# Altium schematic sheet 03_ZYNQ_JTAG_BOOT.SchDoc
size 297 x 209 mm; SheetNumber: 3; SheetTotal: 7
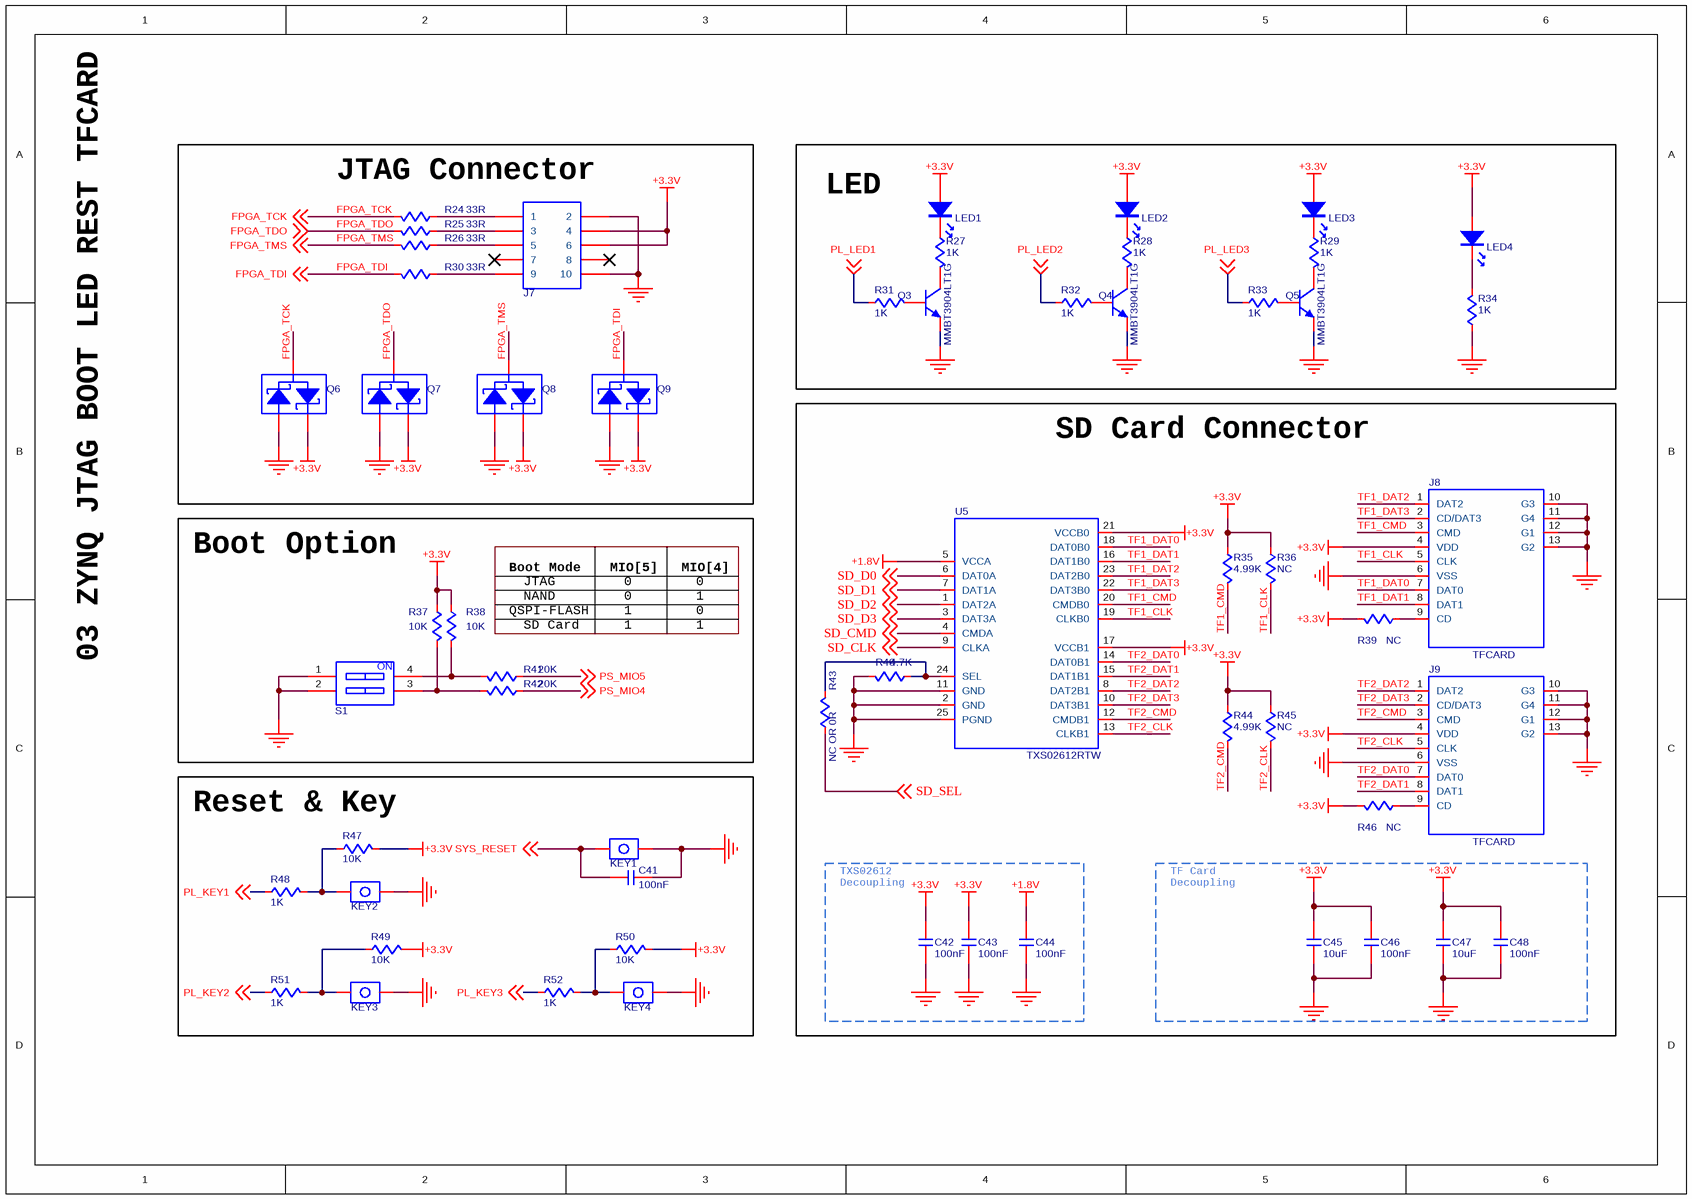
[diagram p0: 03_ZYNQ_JTAG_BOOT.SchDoc]

## Parts
C41  value 100nF  [C0402]  (hidden comment: C-NOMO)
C42  value 100nF  [C0402]  (hidden comment: C-NOMO)
C43  value 100nF  [C0402]  (hidden comment: C-NOMO)
C44  value 100nF  [C0402]  (hidden comment: C-NOMO)
C45  value 10uF  [C0805]  (hidden comment: C-NOMO)
C46  value 100nF  [C0402]  (hidden comment: C-NOMO)
C47  value 10uF  [C0805]  (hidden comment: C-NOMO)
C48  value 100nF  [C0402]  (hidden comment: C-NOMO)
J7  HDR2X5  [HDR2X5-NJ]  (value not drawn)
J8  TFCARD  [TFCARD]
J9  TFCARD  [TFCARD]
KEY1  KEY  [KEY735SO]  (value not drawn)
KEY2  KEY  [KEY735SO]  (value not drawn)
KEY3  KEY  [KEY735SO]  (value not drawn)
KEY4  KEY  [KEY735SO]  (value not drawn)
LED1  LED  [LED0603]  (value not drawn)
LED2  LED  [LED0603]  (value not drawn)
LED3  LED  [LED0603]  (value not drawn)
LED4  LED  [LED0603]  (value not drawn)
Q3  MMBT3904LT1G  [SOT-23]
Q4  MMBT3904LT1G  [SOT-23]
Q5  MMBT3904LT1G  [SOT-23]
Q6  BAT54S  [SOT-23]  (value not drawn)
Q7  BAT54S  [SOT-23]  (value not drawn)
Q8  BAT54S  [SOT-23]  (value not drawn)
Q9  BAT54S  [SOT-23]  (value not drawn)
R24  value 33R  [R0402]  (hidden comment: R)
R25  value 33R  [R0402]  (hidden comment: R)
R26  value 33R  [R0402]  (hidden comment: R)
R27  value 1K  [R0402]  (hidden comment: R)
R28  value 1K  [R0402]  (hidden comment: R)
R29  value 1K  [R0402]  (hidden comment: R)
R30  value 33R  [R0402]  (hidden comment: R)
R31  value 1K  [R0402]  (hidden comment: R)
R32  value 1K  [R0402]  (hidden comment: R)
R33  value 1K  [R0402]  (hidden comment: R)
R34  value 1K  [R0402]  (hidden comment: R)
R35  value 4.99K  [R0402]  (hidden comment: R)
R36  value NC  [R0402]  (hidden comment: R)
R37  value 10K  [R0402]  (hidden comment: R)
R38  value 10K  [R0402]  (hidden comment: R)
R39  value NC  [R0402]  (hidden comment: R)
R40  value 4.7K  [R0402]  (hidden comment: R)
R41  value 20K  [R0402]  (hidden comment: R)
R42  value 20K  [R0402]  (hidden comment: R)
R43  value NC OR 0R  [R0402]  (hidden comment: R)
R44  value 4.99K  [R0402]  (hidden comment: R)
R45  value NC  [R0402]  (hidden comment: R)
R46  value NC  [R0402]  (hidden comment: R)
R47  value 10K  [R0402]  (hidden comment: R)
R48  value 1K  [R0402]  (hidden comment: R)
R49  value 10K  [R0402]  (hidden comment: R)
R50  value 10K  [R0402]  (hidden comment: R)
R51  value 1K  [R0402]  (hidden comment: R)
R52  value 1K  [R0402]  (hidden comment: R)
S1  Switch  [DHN02VTR]  (value not drawn)
U5  TXS02612RTW  [TXS02612TWR]

## Blocks framed on the sheet
JTAG Connector: J7 Q6-Q9 R24-R26 R30
LED: LED1-LED4 Q3-Q5 R27-R29 R31-R34
SD Card Connector: C42-C48 J8 J9 R35 R36 R39 R40 R43-R46 U5
Boot Option: R37 R38 R41 R42 S1
Reset & Key: C41 KEY1-KEY4 R47-R52

## Nets
+1.8V: C44.2 U5.5(VCCA)
+3.3V: C42.2 C43.2 C45.2 C46.2 C47.2 C48.2 J7.4 J7.6 J8.4(VDD) J9.4(VDD) LED1.2 LED2.2 LED3.2 LED4.2 Q6.2 Q7.2 Q8.2 Q9.2 R35.2 R36.2 R37.2 R38.2 R39.1 R44.2 R45.2 R46.1 R47.1 R49.1 R50.1 U5.17(VCCB1) U5.21(VCCB0)
GND: C41.2 C42.1 C43.1 C44.1 C45.1 C46.1 C47.1 C48.1 J7.2 J7.10 J8.6(VSS) J8.10(G3) J8.11(G4) J8.12(G1) J8.13(G2) J9.6(VSS) J9.10(G3) J9.11(G4) J9.12(G1) J9.13(G2) KEY1.2 KEY2.2 KEY3.2 KEY4.2 Q3.2(E) Q4.2(E) Q5.2(E) Q6.1 Q7.1 Q8.1 Q9.1 R34.2 R40.1 S1.1(A1) S1.2(A2) U5.2(GND) U5.11(GND) U5.25(PGND)
FPGA_TCK: Q6.3 R24.1 ; off-sheet FPGA_TCK
FPGA_TDI: Q9.3 R30.1 ; off-sheet FPGA_TDI
FPGA_TDO: Q7.3 R25.1 ; off-sheet FPGA_TDO
FPGA_TMS: Q8.3 R26.1 ; off-sheet FPGA_TMS
PL_KEY1: R48.2 ; off-sheet PL_KEY1
PL_KEY2: R51.2 ; off-sheet PL_KEY2
PL_KEY3: R52.2 ; off-sheet PL_KEY3
PL_LED1: R31.2 ; off-sheet PL_LED1
PL_LED2: R32.2 ; off-sheet PL_LED2
PL_LED3: R33.2 ; off-sheet PL_LED3
PS_MIO4: R42.2 ; off-sheet PS_MIO4
PS_MIO5: R41.2 ; off-sheet PS_MIO5
SD_CLK: U5.9(CLKA) ; off-sheet SD_CLK
SD_CMD: U5.4(CMDA) ; off-sheet SD_CMD
SD_D0: U5.6(DAT0A) ; off-sheet SD_D0
SD_D1: U5.7(DAT1A) ; off-sheet SD_D1
SD_D2: U5.1(DAT2A) ; off-sheet SD_D2
SD_D3: U5.3(DAT3A) ; off-sheet SD_D3
SD_SEL: R43.2 ; off-sheet SD_SEL
SYS_RESET: C41.1 KEY1.1 ; off-sheet SYS_RESET
TF1_CLK: J8.5(CLK) R36.1 U5.19(CLKB0)
TF1_CMD: J8.3(CMD) R35.1 U5.20(CMDB0)
TF1_DAT0: J8.7(DAT0) U5.18(DAT0B0)
TF1_DAT1: J8.8(DAT1) U5.16(DAT1B0)
TF1_DAT2: J8.1(DAT2) U5.23(DAT2B0)
TF1_DAT3: J8.2(CD/DAT3) U5.22(DAT3B0)
TF2_CLK: J9.5(CLK) R45.1 U5.13(CLKB1)
TF2_CMD: J9.3(CMD) R44.1 U5.12(CMDB1)
TF2_DAT0: J9.7(DAT0) U5.14(DAT0B1)
TF2_DAT1: J9.8(DAT1) U5.15(DAT1B1)
TF2_DAT2: J9.1(DAT2) U5.8(DAT2B1)
TF2_DAT3: J9.2(CD/DAT3) U5.10(DAT3B1)
NetJ7_1: J7.1 R24.2
NetJ7_3: J7.3 R25.2
NetJ7_5: J7.5 R26.2
NetJ7_9: J7.9 R30.2
NetJ8_9: J8.9(CD) R39.2
NetJ9_9: J9.9(CD) R46.2
NetKEY2_1: KEY2.1 R47.2 R48.1
NetKEY3_1: KEY3.1 R49.2 R51.1
NetKEY4_1: KEY4.1 R50.2 R52.1
NetLED1_1: LED1.1 R27.2
NetLED2_1: LED2.1 R28.2
NetLED3_1: LED3.1 R29.2
NetLED4_1: LED4.1 R34.1
NetQ3_1: Q3.1(B) R31.1
NetQ3_3: Q3.3(C) R27.1
NetQ4_1: Q4.1(B) R32.1
NetQ4_3: Q4.3(C) R28.1
NetQ5_1: Q5.1(B) R33.1
NetQ5_3: Q5.3(C) R29.1
NetR37_1: R37.1 R42.1 S1.3(B2)
NetR38_1: R38.1 R41.1 S1.4(B1)
NetR40_2: R40.2 R43.1 U5.24(SEL)

Not connected (* = marked no-connect by the designer): J7 7* 8*

## Notes on the sheet
- Boot Mode
- MIO[5]
- MIO[4]
- QSPI-FLASH
- JTAG
- NAND
- SD Card
- 0
- 1
- 03 ZYNQ JTAG BOOT LED REST TFCARD
- TXS02612 Decoupling
- TF Card Decoupling
- (in symbol SW-2) ON

## Library data of the parts
C41-C48 = C-NOMO: voltage: 25V; precision: 5%
Q3-Q5 = NPN
R24-R52 = R: precision: 1%
S1 = SW-2